# EAGLE design doppler-tiny (EAGLE 7.4.0)
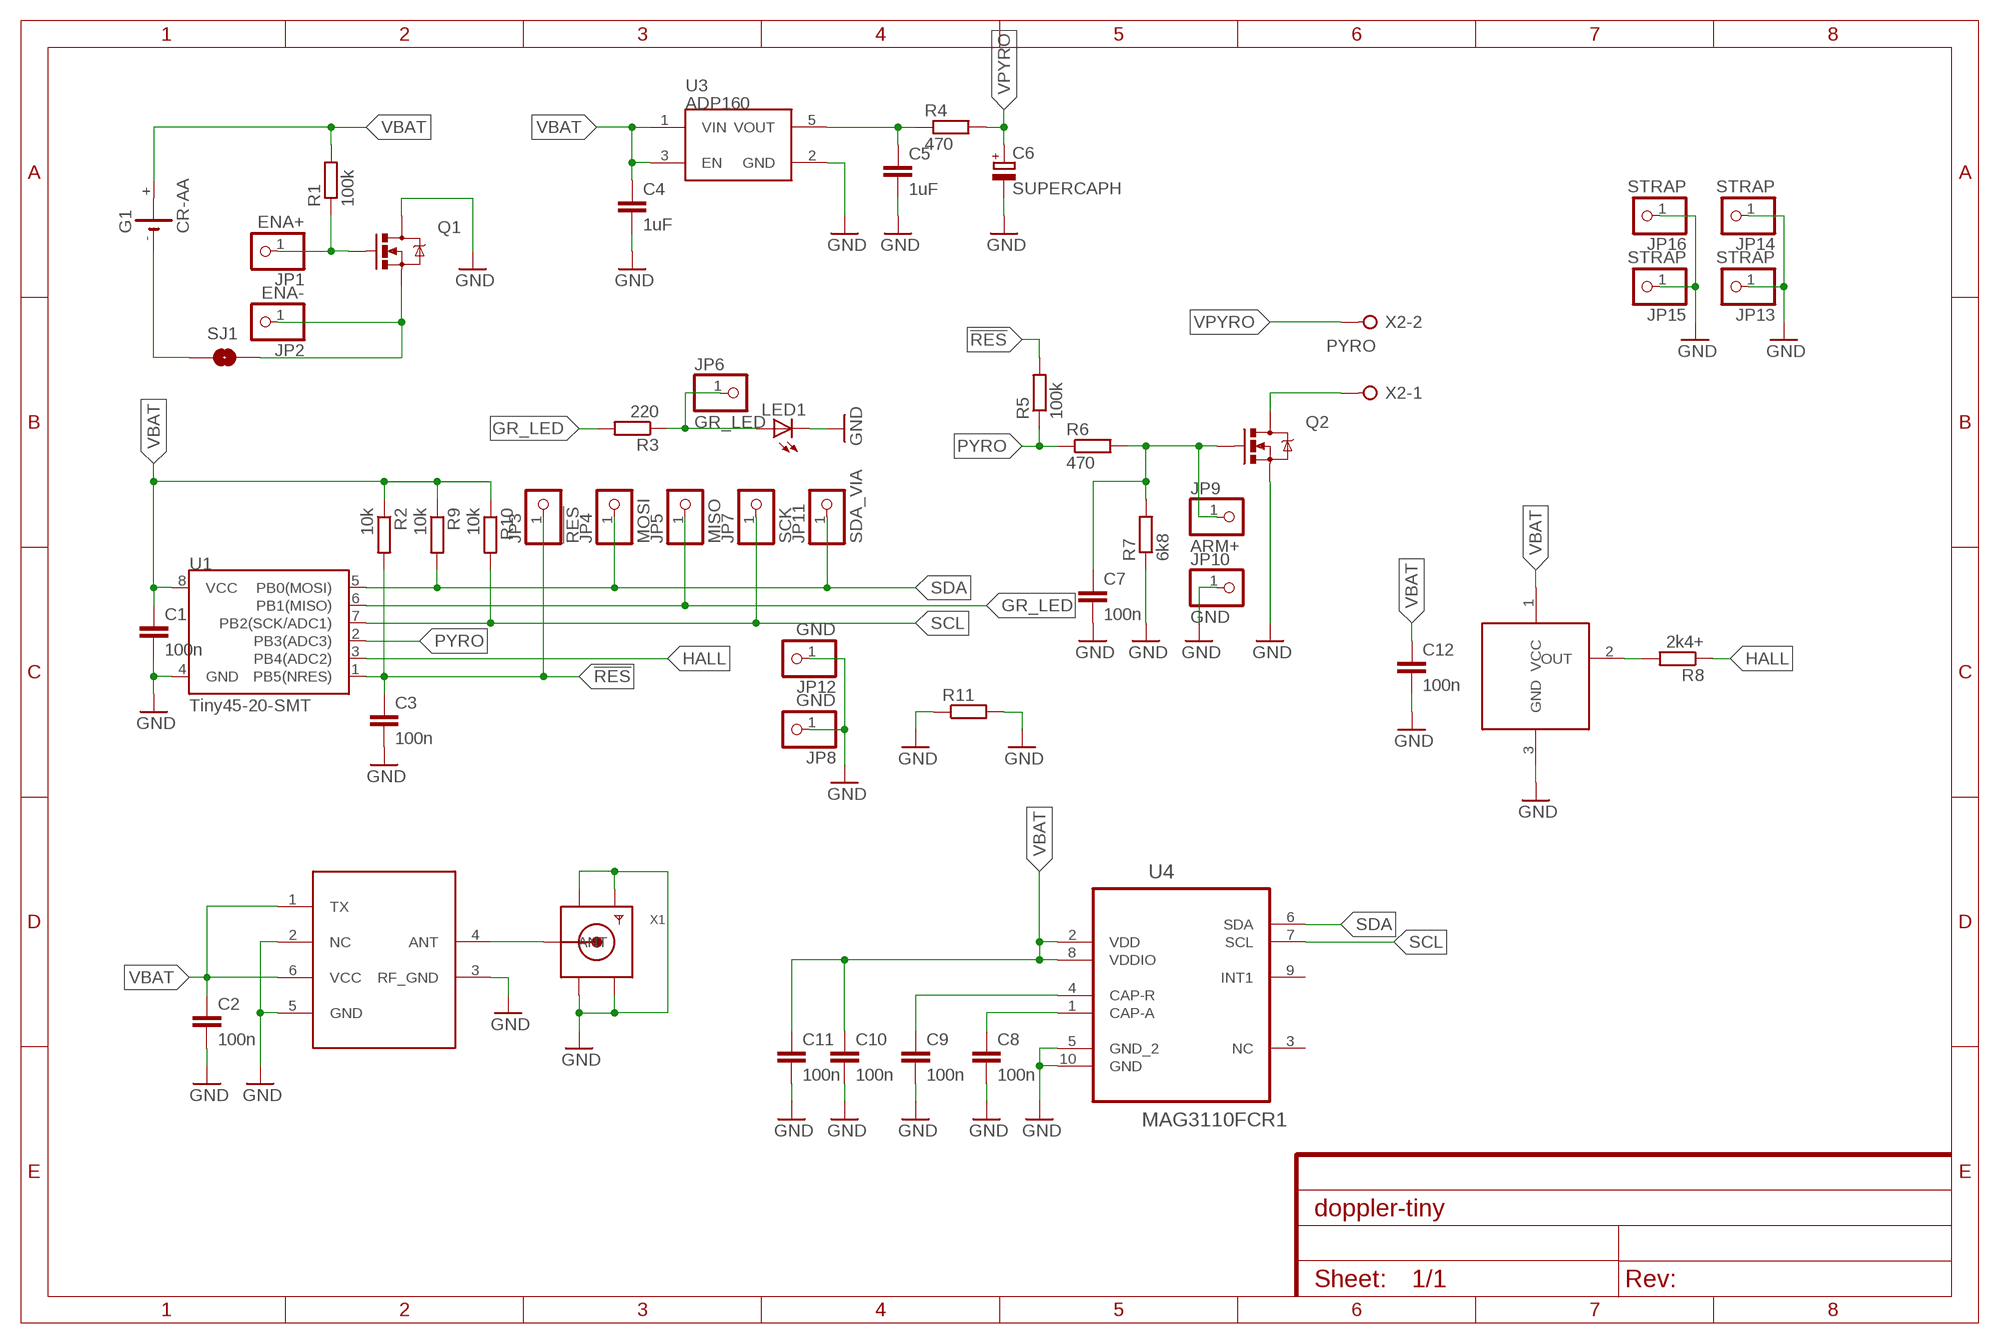
[diagram p0: schematic, sheet 1]

## Parts
C1  100n  C-EUC0603  [C0603]
C2  100n  C-EUC0603  [C0603]
C3  100n  C-EUC0603  [C0603]
C4  1uF  C-EUC0603  [C0603]
C5  1uF  C-EUC0603  [C0603]
C6  SUPERCAPH  [E3,5-8-HOR]
C7  100n  C-EUC0603  [C0603]
C8  100n  C-EUC0603  [C0603]
C9  100n  C-EUC0603  [C0603]
C10  100n  C-EUC0603  [C0603]
C11  100n  C-EUC0603  [C0603]
C12  100n  C-EUC0603  [C0603]
G1  CR-AA  [CRAA]
JP1  ENA+  PINHD-1X1  [1X01]
JP2  ENA-  PINHD-1X1  [1X01]
JP3  !RES  PINHD-1X1  [1X01]
JP4  MOSI  PINHD-1X1  [1X01]
JP5  MISO  PINHD-1X1  [1X01]
JP6  GR_LED  PINHD-1X1  [1X01]
JP7  SCK  PINHD-1X1  [1X01]
JP8  GND  PINHD-1X1  [1X01]
JP9  ARM+  PINHD-1X1  [1X01]
JP10  GND  PINHD-1X1  [1X01]
JP11  SDA_VIA  PINHD-1X1  [1X01]
JP12  GND  PINHD-1X1  [1X01]
JP13  STRAP  PINHD-1X1  [1X01]
JP14  STRAP  PINHD-1X1  [1X01]
JP15  STRAP  PINHD-1X1  [1X01]
JP16  STRAP  PINHD-1X1  [1X01]
LED1  LEDCHIPLED_0805  [CHIPLED_0805]
Q1  MOSFET-NCHANNELBSS123LT1G  [SOT23-3]
Q2  MOSFET-NCHANNELBSS123LT1G  [SOT23-3]
R1  100k  R-EU_R0603  [R0603]
R2  10k  R-EU_R0603  [R0603]
R3  220  R-EU_R0603  [R0603]
R4  470  R-EU_R0603  [R0603]
R5  100k  R-EU_R0603  [R0603]
R6  470  R-EU_R0603  [R0603]
R7  6k8  R-EU_R0603  [R0603]
R8  2k4+  R-EU_R0603  [R0603]
R9  10k  R-EU_R0603  [R0603]
R10  10k  R-EU_R0603  [R0603]
R11  R-EU_R1206  [R1206]
SJ1  JUMPER-PAD-2-NO  [PAD-JUMPER-2-NO_NO_SILK]
U1  Tiny45-20-SMT  ATTINY45TINY45-20-SMT  [SO08-EIAJ]
U2  AUREL-TX-FM-MID  [AUREL-TX-FM-MID]
U3  ADP160  [SOT23-5]
U4  MAG3110FCR1  [DFN200X200X90-10N]
U5  SS39ET  [SOT23]
X1  SMACONNECTOR_EDGE  [SMA_EDGELAUNCH]
X2  PYRO  W237-02P  [W237-132]

## Nets
!RES: C3.1 JP3.1 R2.2 R5.2 U1.1(PB5(NRES))
GND: C1.2 C2.2 C3.2 C4.2 C5.2 C6.- C7.2 C8.2 C9.2 C10.2 C11.2 C12.2 JP8.1 JP10.1 JP12.1 JP13.1 JP14.1 JP15.1 JP16.1 LED1.C Q1.3(D) Q2.2(S) R7.1 R11.1 R11.2 U1.4(GND) U2.2(NC) U2.3(RF_GND) U2.5(GND) U3.2(GND) U4.5(GND_2) U4.10(GND) U5.3(GND) X1.GND@1(GND4) X1.GND@3(GND2) X1.GND@4(GND1)
GR_LED: JP5.1 R3.2 U1.6(PB1(MISO))
HALL: R8.1 U1.3(PB4(ADC2))
N$1: C5.1 R4.1 U3.5(VOUT)
N$2: JP1.1 Q1.1(G) R1.1
N$3: JP2.1 Q1.2(S) SJ1.2
N$4: C8.1 U4.1(CAP-A)
N$5: U2.4(ANT) X1.P(ANT)
N$6: C9.1 U4.4(CAP-R)
N$8: R8.2 U5.2(OUT)
N$9: G1.- SJ1.1
N$133: C7.1 JP9.1 Q2.1(G) R6.2 R7.2
N$137: JP6.1 LED1.A R3.1
N$138: Q2.3(D) X2.1
PYRO: R5.1 R6.1 U1.2(PB3(ADC3))
SCL: JP7.1 R10.2 U1.7(PB2(SCK/ADC1)) U4.7(SCL)
SDA: JP4.1 JP11.1 R9.2 U1.5(PB0(MOSI)) U4.6(SDA)
VBAT: C1.1 C2.1 C4.1 C10.1 C11.1 C12.1 G1.+ R1.2 R2.1 R9.1 R10.1 U1.8(VCC) U2.1(TX) U2.6(VCC) U3.1(VIN) U3.3(EN) U4.2(VDD) U4.8(VDDIO) U5.1(VCC)
VPYRO: C6.+ R4.2 X2.2
Unconnected: U4.3(NC) U4.9(INT1)

## Power pins joined to a net without a drawn wire
GND3: X1.GND@2(GND3)

## Library data of the parts
C1-C5 C7-C12 = rcl:C-EU: CAPACITOR, European symbol
C6 = rotary-launcher:SUPERCAP
G1 = rotary-launcher:CR-AA: LI BATTERY Varta CRAA-SLF
JP1-JP16 = pinhead:PINHD-1X1: PIN HEADER
LED1 = led:LED: LED OSRAM: - CHIPLED LG R971, LG N971, LY N971, LG Q971, LY Q971, LO R971, LY R971 LH N974, LH R974 LS Q976, LO Q976, LY Q976 LO Q996 - Hyper CHIPLED LW Q18S LB Q993, LB Q99A, LB R99A - SideLED LS A670, LO A670, LY A670, LG A670, LP A670 LB A673, LV A673, LT A673, LW A673 LH A674 LY A675 LS A676, LA A676, LO A676, LY A676, LW A676 LS A679, LY A679, LG A679 - Hyper Micro SIDELED® LS Y876, LA Y876, LO Y876, LY Y876 LT Y87S - SmartLED LW L88C, LW L88S LB L89C, LB L89S, LG L890 LS L89K, LO L89K, LY L89K LS L896, LA L896, LO L896, LY L896 - TOPLED LS T670, LO T670, LY T670, LG T670, LP T670 LSG T670, LSP T670, LSY T670, LOP T670, LYG T670 LG T671, LOG T671, LSG T671 LB T673, LV T673, LT T673, LW T673 LH T674 LS T676, LA T676, LO T676, LY T676, LB T676, LH T676, LSB T676, LW T676 LB T67C, LV T67C, LT T67C, LS T67K, LO T67K, LY T67K, LW E67C LS E67B, LA E67B, LO E67B, LY E67B, LB E67C, LV E67C, LT E67C LW T67C LS T679, LY T679, LG T679 LS T770, LO T770, LY T770, LG T770, LP T770 LB T773, LV T773, LT T773, LW T773 LH T774 LS E675, LA E675, LY E675, LS T675 LS T776, LA T776, LO T776, LY T776, LB T776 LHGB T686 LT T68C, LB T68C - Hyper Mini TOPLED® LB M676 - Mini TOPLED Santana® LG M470 LS M47K, LO M47K, LY M47K Source: http://www.osram.convergy.de LUXEON: - LUMILED® LXK2-PW12-R00, LXK2-PW12-S00, LXK2-PW14-U00, LXK2-PW14-V00 LXK2-PM12-R00, LXK2-PM12-S00, LXK2-PM14-U00 LXK2-PE12-Q00, LXK2-PE12-R00, LXK2-PE12-S00, LXK2-PE14-T00, LXK2-PE14-U00 LXK2-PB12-K00, LXK2-PB12-L00, LXK2-PB12-M00, LXK2-PB14-N00, LXK2-PB14-P00, LXK2-PB14-Q00 LXK2-PR12-L00, LXK2-PR12-M00, LXK2-PR14-Q00, LXK2-PR14-R00 LXK2-PD12-Q00, LXK2-PD12-R00, LXK2-PD12-S00 LXK2-PH12-R00, LXK2-PH12-S00 LXK2-PL12-P00, LXK2-PL12-Q00, LXK2-PL12-R00 Source: www.luxeon.com KINGBRIGHT: KA-3528ASYC Source: www.kingbright.com
Q1 Q2 = SparkFun-DiscreteSemi:MOSFET-NCHANNEL: Common NMOSFET Parts MFG P/N Store ID Prod ID FDD8780 TRANS-09984 SI7820DN TRANS-11055 FDS6630A IC-08089 2N7002PW TRANS-11151 FQP30N06L COM-10213 TRANS-10060 BSS123LT1G TRANS-08345 BSS138 TRANS-00830 BS170 2N7000; PROD_ID: TRANS-08345
R1 R2 R4-R11 = rcl:R-EU_: RESISTOR, European symbol
R3 = resistor:R-EU_: RESISTOR, European symbol
SJ1 = SparkFun-Passives:JUMPER-PAD-2-NO
U1 = SparkFun-DigitalIC:ATTINY45: Atmel 8-pin 2/4/8kB flash uC; PROD_ID: IC-08922
U2 = AUREL-TX-FM-MID:AUREL-TX-FM-MID
U3 = SparkFun-PowerIC:ADP160: Nanopower LDO Iq less than 1uA for low Iload; FARNELL: 2510377; PROD_ID: VREG-11306
U4 = gps_tracker:MAG3110FCR1: MAGNETOMETER, 3AXIS, I2C, 80HZ,DFN-10; MPN: MAG3110FCR1; OC_FARNELL: 2080492; OC_NEWARK: 07W3591; PACKAGE: DFN-10; SUPPLIER: FREESCALE SEMICONDUCTOR
U5 = hall sensor:SS39ET
X1 = kg-conn-rf:SMACONNECTOR: SMA Connector 90° DIP SMA Connector, 50 Ohm (4UConnector: 07259)
X2 = con-wago-508:W237-02P: WAGO SREW CLAMP; OC_FARNELL: unknown; OC_NEWARK: unknown

## Board
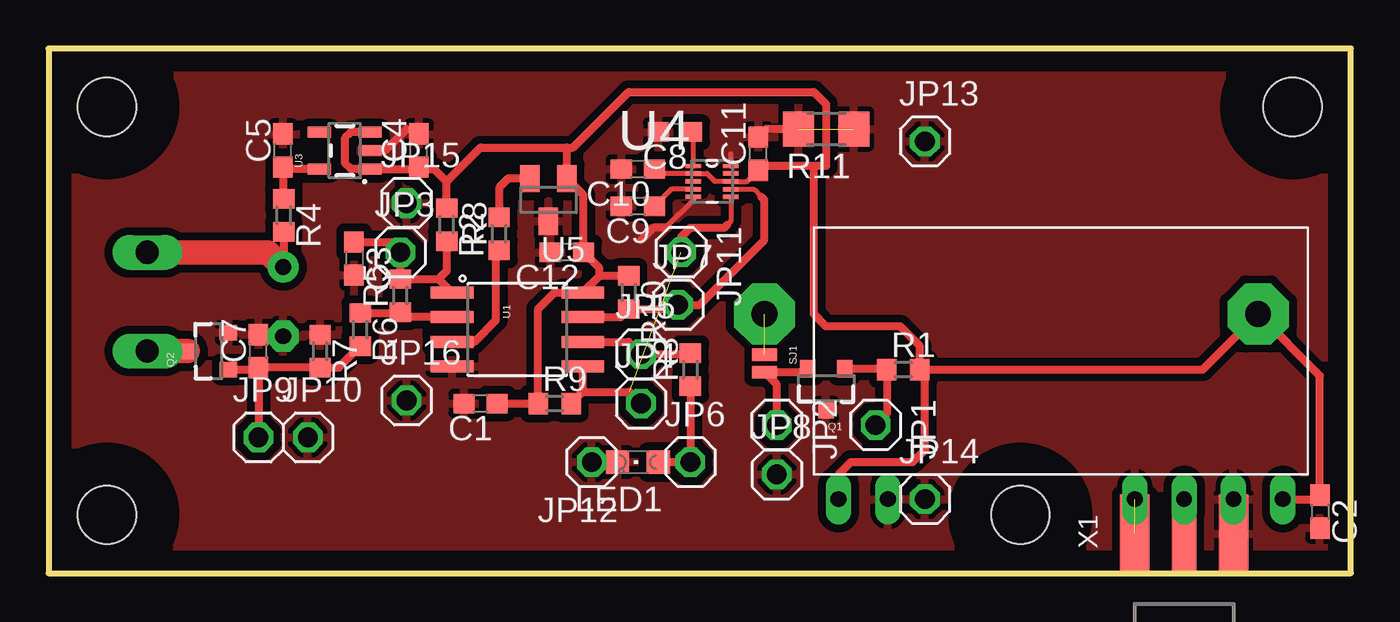
[diagram p1: board, top side]
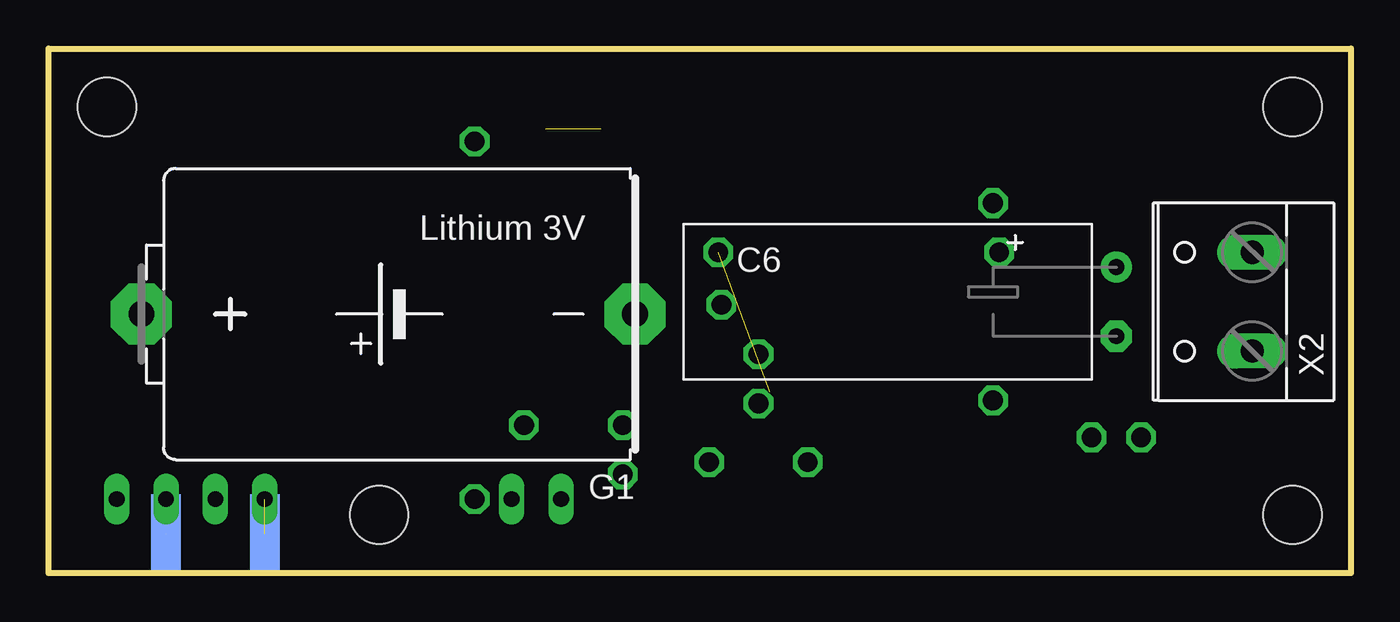
[diagram p2: board, bottom side, seen from below]

Size 67 x 27 mm. Coordinates in mm from the lower left corner, seen from the top.
Outline: 0,0 67,0 67,27 0,27 0,0
Copper layers (1*16): Top 0.035mm / dielectric 1.5mm / Bottom 0.035mm
Design rules "default": minimum track width 10mil, minimum drill 24mil, track to track 8mil, track to pad 8mil, pad to pad 8mil, via to via 8mil, smd to smd 8mil, copper to edge 40mil, drill to drill 8mil, minimum pad ring 10mil, minimum via ring 8mil, stop-mask expansion 4mil, vias tented up to drill 0mil, thermal gap 10mil
Holes 3 mm at 3,3 3,24 64,24 50,3
tRestrict: area -0.1,-0.1 to 6.1,6.1; area -0.1,20.9 to 6.1,27.1; area 60.9,20.9 to 67.1,27.1; area 46.9,-0.1 to 53.1,6.1

### Footprints (pad centres in the part's own frame; a part is rotated, then mirrored left to right if it is on the bottom)
C0603 = smd 1.1 x 1: 1 -0.85,0; 2 0.85,0
E3,5-8-HOR = drill 0.813 pad 1.6: + -1.778,0 | drill 0.813 pad 1.6 octagon: - 1.778,0
CRAA = drill 1.321 pad 3.15 octagon: + 12.7,0; - -12.7,0
1X01 = drill 1.016 octagon: 1 0,0
CHIPLED_0805 = smd 1.2 x 1.2: A 0,-1.05; C 0,1.05
SOT23-3 = smd 0.8 x 0.9: 1 -0.95,-1; 2 0.95,-1; 3 0,1.1
R0603 = smd 1 x 1.1: 1 -0.85,0; 2 0.85,0
R1206 = smd 1.6 x 1.803: 1 -1.422,0; 2 1.422,0
PAD-JUMPER-2-NO_NO_SILK = smd 0.635 x 1.27: 1 -0.45,0; 2 0.45,0
SO08-EIAJ = smd 0.61 x 2.21: 1 -1.905,-3.378; 2 -0.635,-3.378; 3 0.635,-3.378; 4 1.905,-3.378; 5 1.905,3.353; 6 0.635,3.353; 7 -0.635,3.353; 8 -1.905,3.353
AUREL-TX-FM-MID = drill 0.813 long: 1 -11.43,-5.08; 2 -8.89,-5.08; 3 3.81,-5.08; 4 6.35,-5.08; 5 8.89,-5.08; 6 11.43,-5.08
SOT23-5 = smd 0.55 x 1.2: 1 -0.95,-1.3; 2 0,-1.3; 3 0.95,-1.3; 4 0.95,1.3; 5 -0.95,1.3
DFN200X200X90-10N = smd 0.813 x 0.229: 1 -0.965,0.787; 2 -0.965,0.406; 3 -0.965,0; 4 -0.965,-0.406; 5 -0.965,-0.787; 6 0.965,-0.787; 7 0.965,-0.406; 8 0.965,0; 9 0.965,0.406; 10 0.965,0.787
SOT23 = smd 1 x 1.4: 1 -0.95,-1.1; 2 0.95,-1.1; 3 0,1.1
SMA_EDGELAUNCH = smd 4.064 x 1.524: GND@1 2.032,-2.54; GND@2 2.032,2.54 | smd 4.064 x 1.524 bottom: GND@3 2.032,2.54; GND@4 2.032,-2.54 | smd 4.064 x 1.27: P 2.032,0
W237-132 = drill 1.194 long: 1 -2.54,-0.635; 2 2.54,-0.635

### Placement (x,y rotation side)
C1  22.23,8.73 180 top
C2  65.41,3.17 270 top
C3  15.72,16.19 270 top
C4  19.05,21.75 90 top
C5  12.06,21.75 90 top
C6  12.06,13.97 270 bottom
C7  10.79,11.43 90 top
C8  32.23,22.7 180 top
C9  30.32,18.89 180 top
C10  30.32,20.8 180 top
C11  36.51,21.59 90 top
C12  26.67,16.51 180 top
G1  49.53,13.34 180 bottom
JP1  42.55,7.62 270 top
JP2  37.47,7.62 270 top
JP3  18.1,16.51 0 top
JP4  30.48,8.73 0 top
JP5  30.48,11.27 0 top
JP6  33.02,5.71 0 top
JP7  32.38,13.81 0 top
JP8  37.47,5.08 0 top
JP9  10.79,6.99 0 top
JP10  13.34,6.99 0 top
JP11  32.54,16.51 270 top
JP12  27.94,5.71 180 top
JP13  45.09,22.23 0 top
JP14  45.09,3.81 0 top
JP15  18.41,19.05 0 top
JP16  18.41,8.89 0 top
LED1  30.32,5.71 90 top
Q1  40.01,9.53 180 top
Q2  8.26,11.43 90 top
R1  43.97,10.48 0 top
R2  20.48,17.94 270 top
R3  33.02,10.48 90 top
R4  12.1,18.41 270 top
R5  18.1,14.29 90 top
R6  16.03,12.54 270 top
R7  13.97,11.43 270 top
R8  23.18,17.46 90 top
R9  26.04,8.73 0 top
R10  29.84,14.45 270 top
R11  40.01,22.86 180 top
SJ1  36.83,10.79 270 top
U1  24.13,12.54 270 top
U2  52.07,8.89 0 top
U3  15.24,21.75 90 top
U4  34.13,20.16 0 top
U5  25.72,19.21 180 top
X1  58.42,0 90 top
X2  5.71,13.97 90 bottom

### Tracks (layer width: path | path; a pad name or v marks a point on that pad's centre or on a via)
!RES
  Top 0.406: 20.06,15.14 R5.2 JP3.1 18,17.04 C3.1 | 20.06,15.14 U1.1 | R2.2 20.48,15.56 20.06,15.14
GND  (3 unrouted)
  Top 0.25: U4.10 35.1,21.58 35.08,21.59 | U4.5 33.17,19.2 31.75,17.78
  Top 0.406: R11.2 36.93,22.86 C11.2 | U3.2 17.3,21.75 18.41,22.86 | 31.75,17.78 31.11,17.78 30.48,17.14
  pour Top (isolate 0.406): -0.64,-0.64 67.94,-0.64 67.94,27.94 -0.64,27.94
GR_LED
  Top 0.406: U1.6 29.84,11.91 JP5.1 32.96,11.27 R3.2
HALL
  Top 0.406: U1.3 21.91,11.91 23.02,13.02 23.02,16.45 R8.1
N$1
  Top 0.406: U3.5 12.16,20.8 C5.1 12.1,20.86 R4.1
N$2
  Top 0.406: Q1.1 43.08,10.53 R1.1 43.12,8.2 JP1.1
N$3
  Top 0.406: Q1.2 38.88,10.35 SJ1.2 37.47,9.71 JP2.1
N$4
  Top 0.25: U4.1 33.17,22.61 C8.1
N$5
  Top 0.406: U2.4 X1.P
N$6
  Top 0.25: U4.4 32.03,19.75 C9.1
N$7
  pour Top: 46.35,25.4 59.69,25.4 59.69,18.41 46.35,18.41
N$8
  Top 0.406: U5.2 23.64,20.31 23.18,19.84 R8.2
N$9  (1 unrouted)
N$133
  Top 0.406: R6.2 14.92,10.58 R7.2 C7.1 | Q2.1 10.7,10.48 C7.1 | C7.1 JP9.1
N$137
  Top 0.406: R3.1 JP6.1 LED1.A
N$138
  Top 1.27: Q2.3 X2.1
PYRO
  Top 0.406: U1.2 18.36,13.18 R5.1 18.05,13.39 R6.1
SCL
  Top 0.25: U4.7 36.28,19.75 36.67,19.37
  Top 0.406: U1.7 29.43,13.18 R10.2 32.17,13.6 JP7.1 33.5,13.81 36.83,17.14 36.83,19.21 36.67,19.37
SDA  (1 unrouted)
  Top 0.25: U4.6 35.1,18.11 34.92,17.94
  Top 0.406: U1.5 27.48,9.33 | 27.48,9.33 R9.2 | 27.48,9.33 29.88,9.33 JP4.1 | JP11.1 32.54,17.3 33.02,17.78 34.77,17.78 34.92,17.94
VBAT
  Top 0.25: C10.1 31.4,20.57 U4.2 33.88,20.57 34.29,20.16 U4.8 35.93,20.16 C11.1
  Top 0.406: U3.3 15.55,22.7 15.24,22.38 15.24,21.11 15.55,20.8 U3.1 18.95,20.8 C4.1 19.15,20.8 19.84,20.8 20.48,20.16 | C1.1 R9.1 25.18,13.6 26.04,14.45 U1.8 28.33,15.3 | R10.1 28.33,15.3 | R2.1 20.48,20.16 | 28.33,15.3 28.33,15.7 C12.1 27.52,19.46 U5.1 | 20.48,20.16 22.23,21.91 26.67,21.91 | 26.67,21.91 26.99,21.91 29.84,24.77 39.37,24.77 40.01,24.13 40.01,20.95 39.37,20.95 | U5.1 | R1.2 59.37,10.48 G1.+ 65.41,10.16 C2.1 65.19,3.81 U2.6 | U2.1 40.64,5.08 41.27,5.71 44.45,5.71 45.09,6.35 45.09,10.22 R1.2 | 39.37,20.95 36.73,20.95 C11.1 | U5.1 26.67,21.91 | R1.2 44.82,11.69 43.81,12.7 40.01,12.7 39.37,13.34 39.37,20.95
VPYRO
  Top 0.406: R4.2 12.1,15.78 C6.+
  Top 1.27: X2.2 11.3,16.51 C6.+

### Text on the board
tRestrict: Pyro / Doppler